# EAGLE design x (EAGLE 7.1.0)
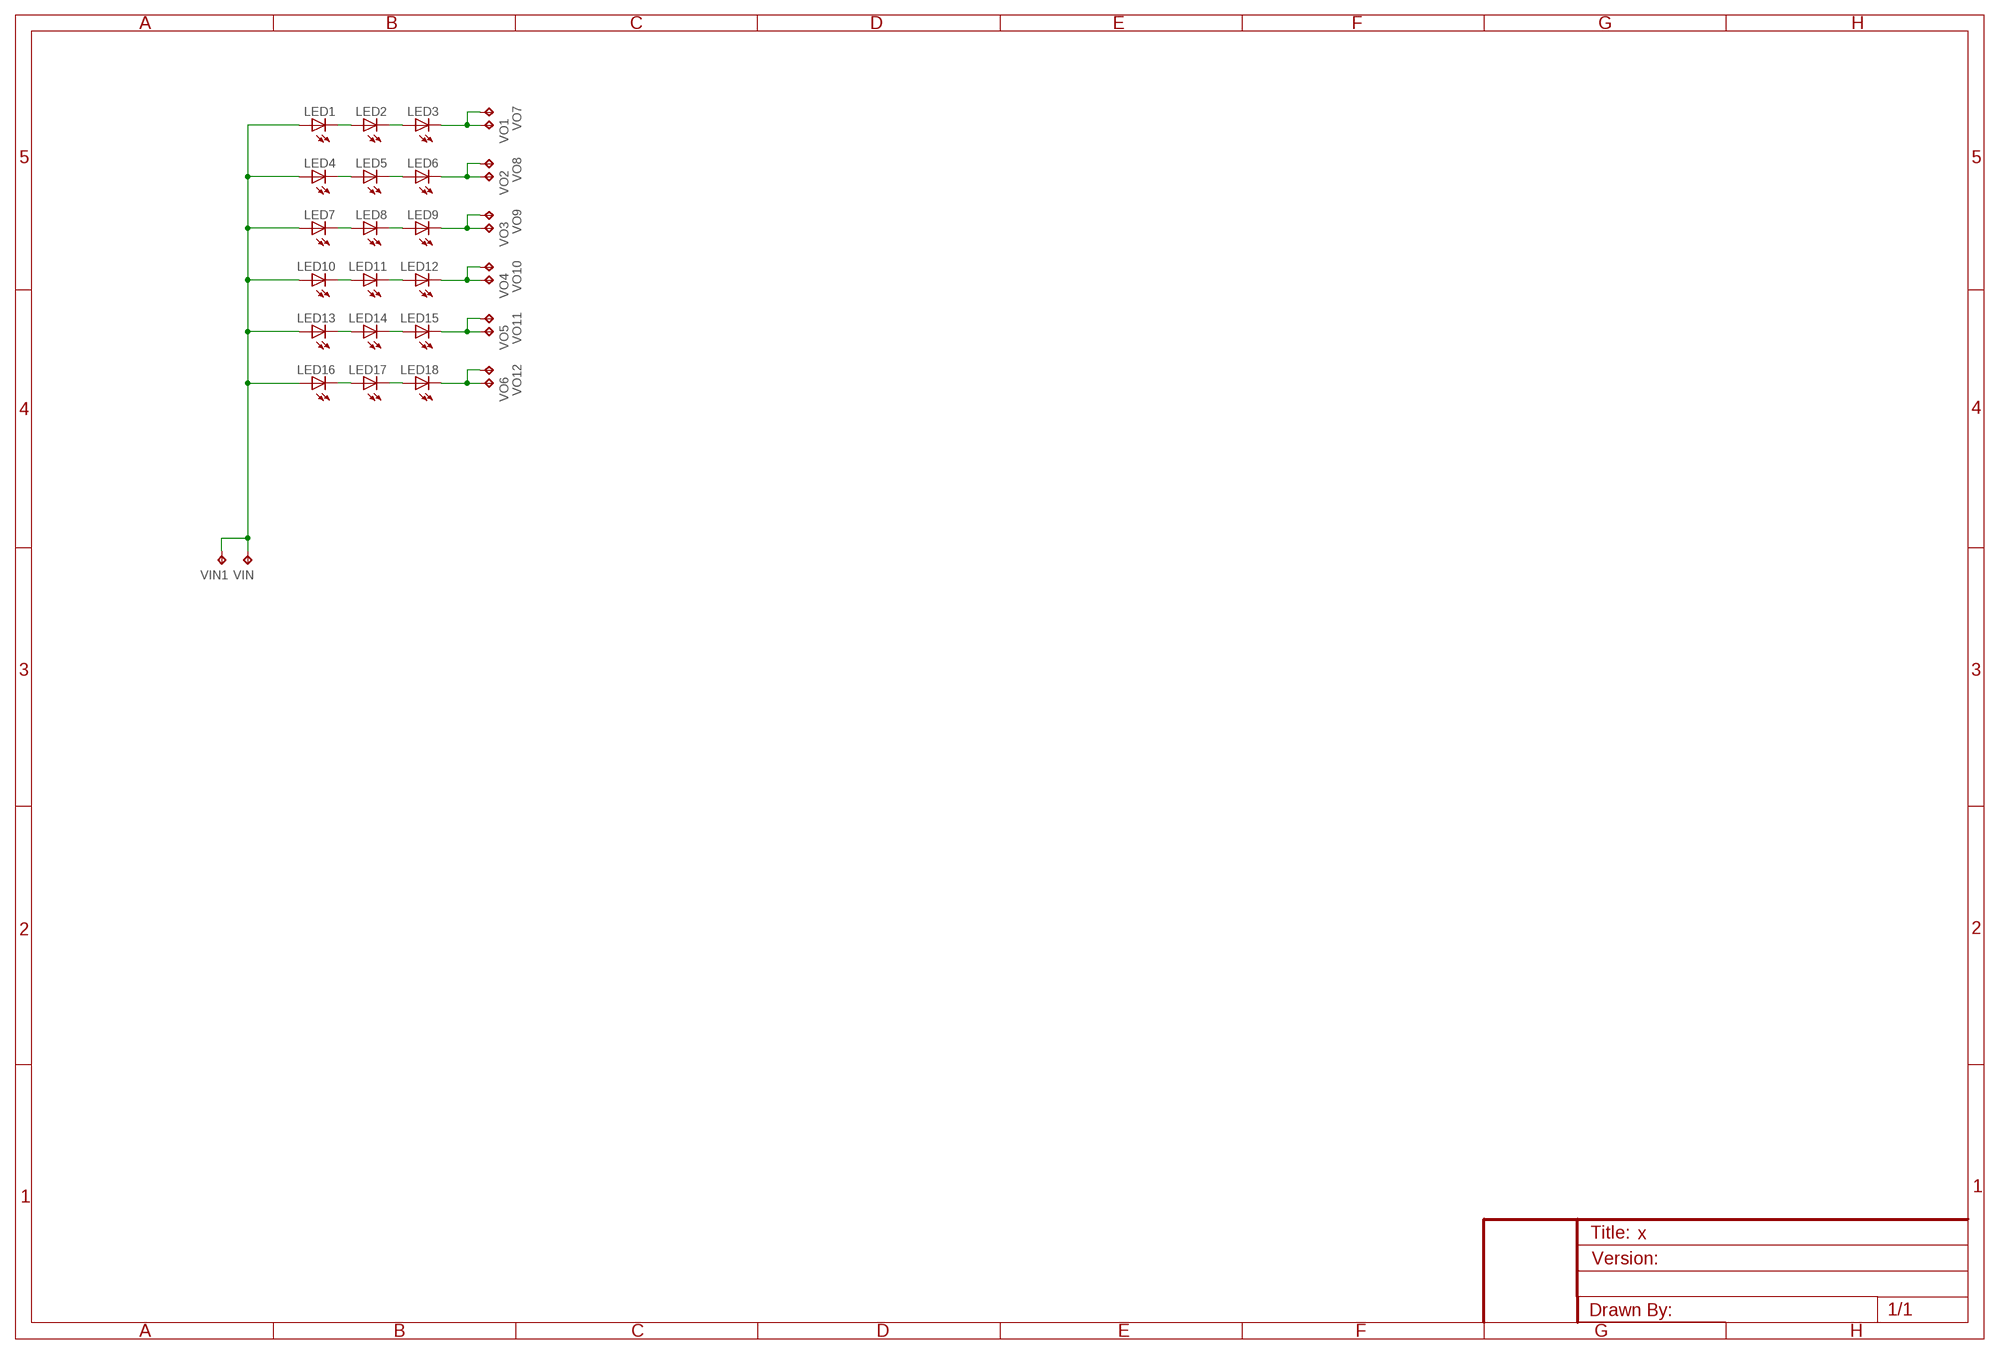
[diagram p0: schematic, sheet 1]

## Parts
LED1  LED0805  [LED_0805]
LED2  LED0805  [LED_0805]
LED3  LED0805  [LED_0805]
LED4  LED0805  [LED_0805]
LED5  LED0805  [LED_0805]
LED6  LED0805  [LED_0805]
LED7  LED0805  [LED_0805]
LED8  LED0805  [LED_0805]
LED9  LED0805  [LED_0805]
LED10  LED0805  [LED_0805]
LED11  LED0805  [LED_0805]
LED12  LED0805  [LED_0805]
LED13  LED0805  [LED_0805]
LED14  LED0805  [LED_0805]
LED15  LED0805  [LED_0805]
LED16  LED0805  [LED_0805]
LED17  LED0805  [LED_0805]
LED18  LED0805  [LED_0805]
VIN  TEST_POINTPAD1-20  [P1-20]
VIN1  TEST_POINTPAD1-20  [P1-20]
VO1  TEST_POINTPAD1-20  [P1-20]
VO2  TEST_POINTPAD1-20  [P1-20]
VO3  TEST_POINTPAD1-20  [P1-20]
VO4  TEST_POINTPAD1-20  [P1-20]
VO5  TEST_POINTPAD1-20  [P1-20]
VO6  TEST_POINTPAD1-20  [P1-20]
VO7  TEST_POINTPAD1-20  [P1-20]
VO8  TEST_POINTPAD1-20  [P1-20]
VO9  TEST_POINTPAD1-20  [P1-20]
VO10  TEST_POINTPAD1-20  [P1-20]
VO11  TEST_POINTPAD1-20  [P1-20]
VO12  TEST_POINTPAD1-20  [P1-20]

## Nets
N$3: LED2.C LED3.A
N$4: LED1.C LED2.A
N$7: LED5.C LED6.A
N$8: LED4.C LED5.A
N$11: LED8.C LED9.A
N$12: LED7.C LED8.A
N$15: LED11.C LED12.A
N$16: LED10.C LED11.A
N$19: LED14.C LED15.A
N$20: LED13.C LED14.A
N$23: LED17.C LED18.A
N$24: LED16.C LED17.A
VIN: LED1.A LED4.A LED7.A LED10.A LED13.A LED16.A VIN1.TP VIN.TP
VOUT1: LED3.C VO1.TP VO7.TP
VOUT2: LED6.C VO2.TP VO8.TP
VOUT3: LED9.C VO3.TP VO9.TP
VOUT4: LED12.C VO4.TP VO10.TP
VOUT5: LED15.C VO5.TP VO11.TP
VOUT6: LED18.C VO6.TP VO12.TP

## Library data of the parts
LED1-LED18 = CyberRailGuru:LED: LEDs Standard schematic elements and footprints for 5mm, 3mm, 1206, and 0603 sized LEDs. 5mm - Spark Fun Electronics SKU : COM-00529 (and others)
VIN VIN1 VO1-VO12 = CyberRailGuru:TEST_POINT: Test pad

## Board
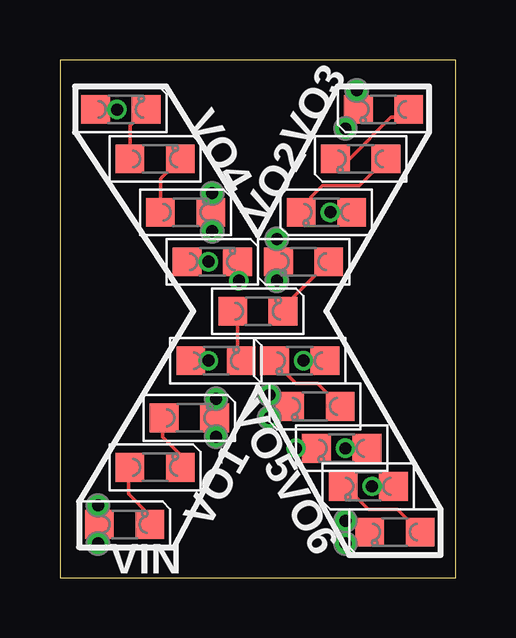
[diagram p1: board, top side]
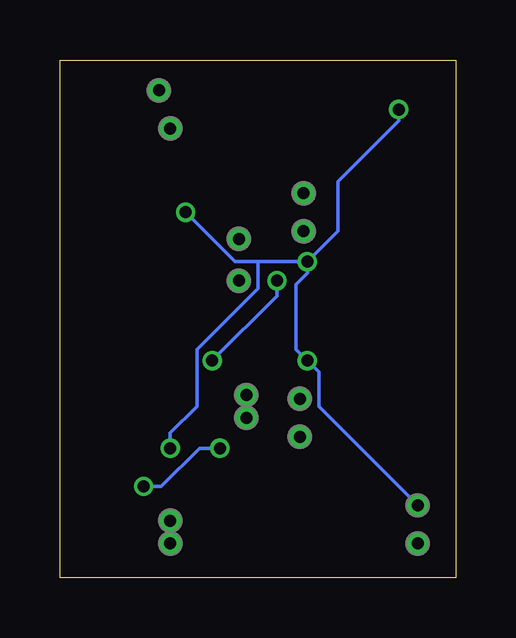
[diagram p2: board, bottom side, seen from below]

Size 16.51 x 21.59 mm. Coordinates in mm from the lower left corner, seen from the top.
Outline: 0,0 16.51,0 16.51,21.59 0,21.59 0,0
Copper layers (1*16): Top 0.035mm / dielectric 1.5mm / Bottom 0.035mm
Design rules "Fusion_eagle_rule_v1.1_tms *": minimum track width 6mil, minimum drill 12mil, track to track 6mil, track to pad 6mil, pad to pad 6mil, via to via 6mil, smd to smd 0mil, copper to edge 10mil, drill to drill 10mil, minimum pad ring 10mil, minimum via ring 6mil, stop-mask expansion 2mil, vias tented up to drill 100mil, thermal gap 10mil

### Footprints (pad centres in the part's own frame; a part is rotated, then mirrored left to right if it is on the bottom)
LED_0805 = smd 1.2 x 1.2: A 0,-1.05; C 0,1.05
P1-20 = drill 0.5: TP 0,0

### Placement (x,y rotation side)
LED1  2.7,2.22 270 top
LED2  3.97,4.6 270 top
LED3  5.4,6.67 270 top
LED4  6.51,9.05 270 top
LED5  8.26,11.11 270 top
LED6  10.16,13.18 90 top
LED7  11.11,15.24 90 top
LED8  12.54,17.46 90 top
LED9  13.49,19.53 90 top
LED10  2.54,19.53 270 top
LED11  3.97,17.46 270 top
LED12  5.24,15.24 270 top
LED13  6.35,13.18 270 top
LED14  10,9.05 90 top
LED15  10.64,7.14 90 top
LED16  11.75,5.4 90 top
LED17  12.86,3.81 90 top
LED18  13.97,1.91 90 top
VIN  1.59,1.43 0 top
VIN1  1.59,3.02 0 top
VO1  6.51,5.87 0 top
VO2  9.05,14.13 0 top
VO3  11.91,18.73 0 top
VO4  6.35,14.45 0 top
VO5  8.73,7.62 0 top
VO6  11.91,2.38 0 top
VO7  6.51,7.46 0 top
VO8  9.05,12.38 0 top
VO9  12.38,20.32 0 top
VO10  6.35,16.03 0 top
VO11  8.73,6.67 0 top
VO12  11.91,1.43 0 top

### Tracks (layer width: path | path; a pad name or v marks a point on that pad's centre or on a via)
N$3
  Top 0.152: LED2.C 5.02,5.14 4.29,5.87 4.29,6.61 LED3.A
N$4
  Top 0.152: LED1.C 3.75,2.6 2.86,3.49 2.86,4.54 LED2.A
N$7
  Top 0.152: LED5.C 9.3,11.27 LED6.A
N$8
  Top 0.152: LED5.A 7.4,10.92 7.4,9.21 LED4.C
N$11
  Top 0.152: LED8.C 12.06,17.46 13.81,19.21 14.23,19.21 LED9.A
N$12
  Top 0.152: LED7.C 10.48,15.24 10.48,15.88 10.95,16.35 12.48,16.35 LED8.A
N$15
  Top 0.152: LED12.A 4.19,16.63 LED11.C
N$16
  Top 0.152: LED11.A 2.92,18.86 LED10.C
N$19
  Top 0.152: 11.53,7.3 LED15.A 10.73,8.1 9.84,8.1 8.95,8.99 LED14.C
N$20  (via drill 0.5)
  Top 0.152: LED13.C 7.4,12.44 v7.46,12.38 | v10.16,9.05 LED14.A
  Bottom 0.152: v7.46,12.38 7.46,11.75 v10.16,9.05
N$23
  Top 0.152: LED17.C 11.91,3.81 12.86,2.86 14.07,2.86 LED18.A
N$24  (via drill 0.5)
  Top 0.152: LED16.C v9.84,5.4 | v13.02,3.81 LED17.A
  Bottom 0.152: v13.02,3.81 12.29,3.81 LED16.C v9.84,5.4
VIN  (via drill 0.5)
  Top 0.152: VIN1.TP 1.59,2.28 LED1.A 1.59,2.16 VIN.TP | LED4.A v6.19,9.05 | LED7.A v11.27,15.24 | LED10.A v2.38,19.53 | LED16.A v11.91,5.4 | LED13.A v6.19,13.18
  Bottom 0.152: VIN1.TP 5.71,7.14 5.71,8.57 v6.19,9.05 6.67,9.53 6.67,12.22 6.19,12.7 v6.19,13.18 | v2.38,19.53 2.38,19.05 4.92,16.51 4.92,14.45 v6.19,13.18 | v11.91,5.4 11.91,6.03 10.79,7.14 10.79,9.53 8.26,12.06 8.26,13.18 | v6.19,13.18 8.26,13.18 | 8.26,13.18 9.21,13.18 v11.27,15.24
VOUT1
  Top 0.152: VO7.TP 6.51,6.73 LED3.C 6.51,6.61 VO1.TP
VOUT2
  Top 0.152: VO2.TP 9.05,13.24 LED6.C 9.05,13.12 VO8.TP
VOUT3
  Top 0.152: 12.38,19.46 LED9.C | VO9.TP 12.38,19.59 LED9.C | VO3.TP 11.91,18.99 LED9.C
VOUT4
  Top 0.152: VO4.TP 6.35,15.18 LED12.C 6.35,15.3 VO10.TP
VOUT5
  Top 0.152: 9.37,6.92 LED15.C | VO5.TP 9.11,7.62 LED15.C | VO11.TP 9.11,6.67 LED15.C
VOUT6
  Top 0.152: VO6.TP 12.44,2.38 LED18.C 12.44,1.43 VO12.TP

### Text on the board
201bmp: X